# EAGLE design UARTBreakout-2.0 (EAGLE 9.6.2)
Assembly variants: JLCPCB
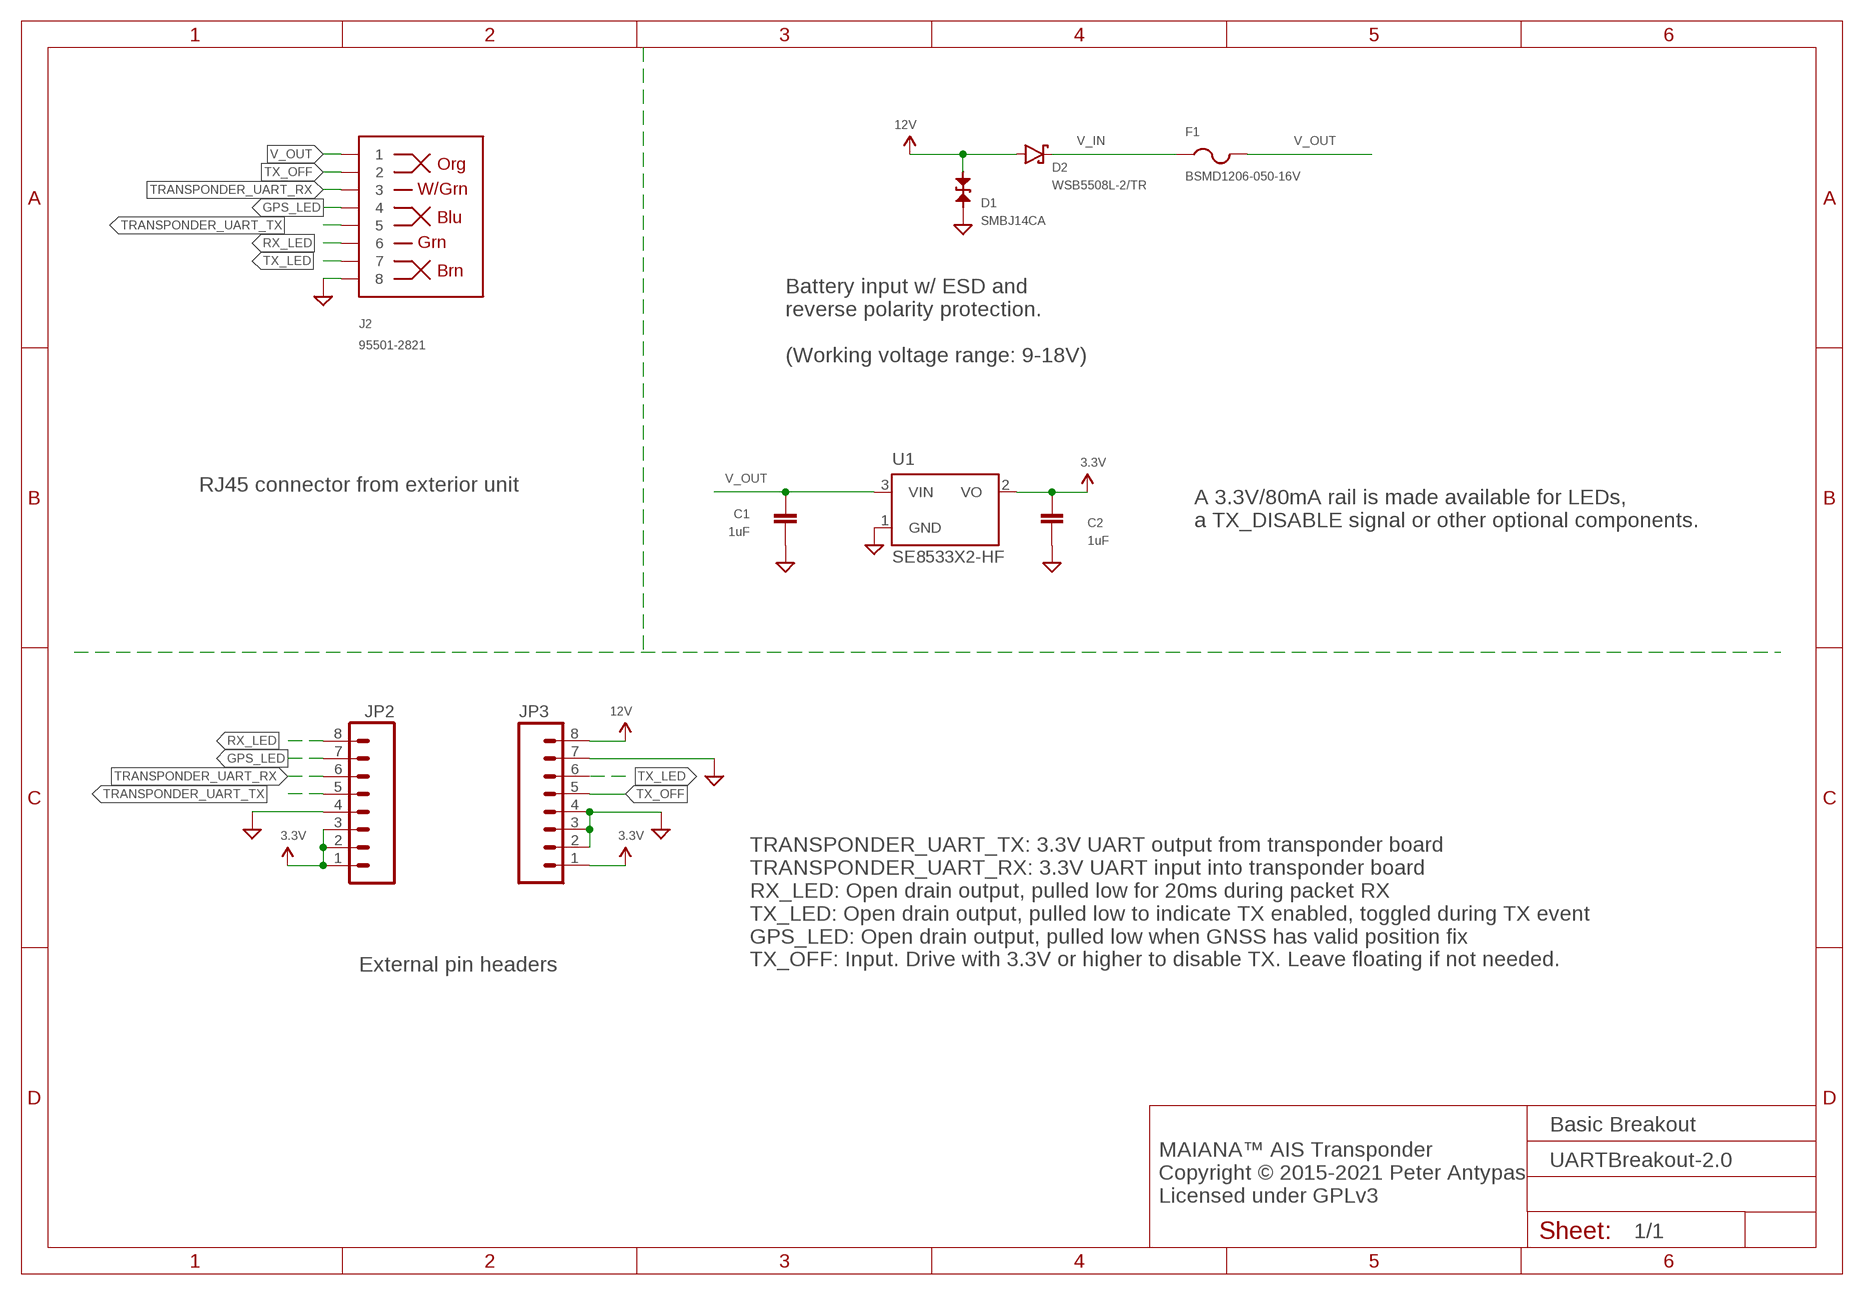
[diagram p0: schematic, sheet 1]

## Parts
C1  1uF  CAPACITOR0603  [0603]
C2  1uF  CAPACITOR0603  [0603]
D1  SMBJ14CA  DIODE-TVS-BIDIRSMB  [SMB-BIDIR]
D2  WSB5508L-2/TR  DIODE-SCHOTTKYSOD123  [SOD123]
F1  BSMD1206-050-16V  PTCFUSE-1206  [R1206]
J2  95501-2821  RJ45-8PTH  [RJ45-8]
JP2  M08SILK_FEMALE_PTH  [1X08]
JP3  M08SILK_FEMALE_PTH  [1X08]
U1  SE8533X2-HF  MCP1799T  [SOT23]

## Nets
3.3V: C2.P$1 JP2.1 JP2.2 JP2.3 JP3.1 U1.2(VO)
12V: D1.A D2.A JP3.8
GND: C1.P$2 C2.P$2 D1.C J2.8 JP2.4 JP3.2 JP3.3 JP3.4 JP3.7 U1.1(GND)
GPS_LED: J2.4 JP2.7
RX_LED: J2.6 JP2.8
TRANSPONDER_UART_RX: J2.3 JP2.6
TRANSPONDER_UART_TX: J2.5 JP2.5
TX_LED: J2.7 JP3.6
TX_OFF: J2.2 JP3.5
V_IN: D2.C F1.1
V_OUT: C1.P$1 F1.2 J2.1 U1.3(VIN)

## Notes on the sheet
- Battery input w/ ESD and 
  reverse polarity protection.
  
  (Working voltage range: 9-18V)
- RJ45 connector from exterior unit
- A 3.3V/80mA rail is made available for LEDs,
  a TX_DISABLE signal or other optional components.
- External pin headers
- TRANSPONDER_UART_TX: 3.3V UART output from transponder board
  TRANSPONDER_UART_RX: 3.3V UART input into transponder board
  RX_LED: Open drain output, pulled low for 20ms during packet RX
  TX_LED: Open drain output, pulled low to indicate TX enabled, toggled during TX event
  GPS_LED: Open drain output, pulled low when GNSS has valid position fix
  TX_OFF: Input. Drive with 3.3V or higher to disable TX. Leave floating if not needed.
- Basic Breakout
- MAIANA™ AIS Transponder
  Copyright © 2015-2021 Peter Antypas
  Licensed under GPLv3

## Library data of the parts
C1 C2 = MyPassives:CAPACITOR: Standard SMD capacitor; PARTNO: CC0603KRX5R8BB105
D1 = MyDiodes:DIODE-TVS-BIDIR: Bidirectional TVS diode; PARTNO: SMBJ14CA
D2 = MyDiodes:DIODE-SCHOTTKY: Standard SMD Schottky diode; PARTNO: WSB5508L-2/TR
F1 = adafruit:PTCFUSE: PTC fuses, resettable thermistors; PARTNO: BSMD1206-050-16V
J2 = SparkFun-Connectors:RJ45-8: RJ45 Jack Simple RJ45, 8-pin connection - connector for common Cat5, Cat5e, and Cat6 Ethernet cables. Footprint not yet proven in production. Connector sku is PRT-00643; Breakout PCB sku is BOB-00716.; PARTNO: 95501-2821; PROD_ID: CONN-08506; VALUE: RJ45
JP2 JP3 = SparkFun-Connectors:M08: Header 8 Standard 8-pin 0.1" header. Use with straight break away headers (SKU : PRT-00116), right angle break away headers (PRT-00553), swiss pins (PRT-00743), machine pins (PRT-00117), and female headers (PRT-00115).; PROD_ID: CONN-08438
U1 = microchip:MCP1799T: 80mA High Voltage Automotive LDO; PARTNO: SE8533X2-HF; VALUE: MCP1799T

## Board
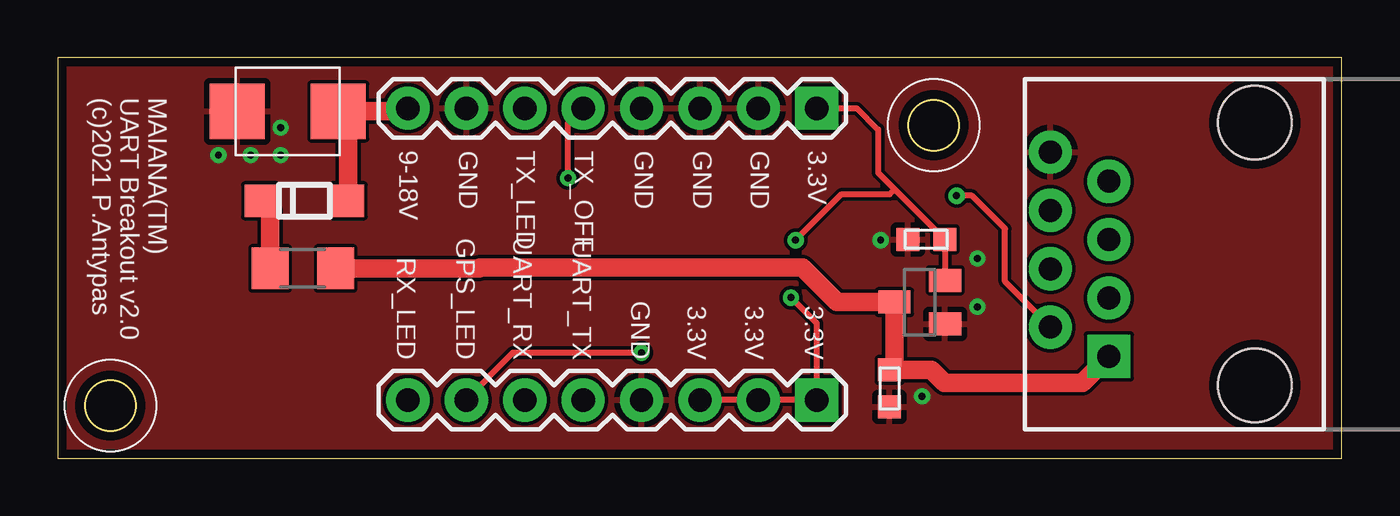
[diagram p1: board, top side]
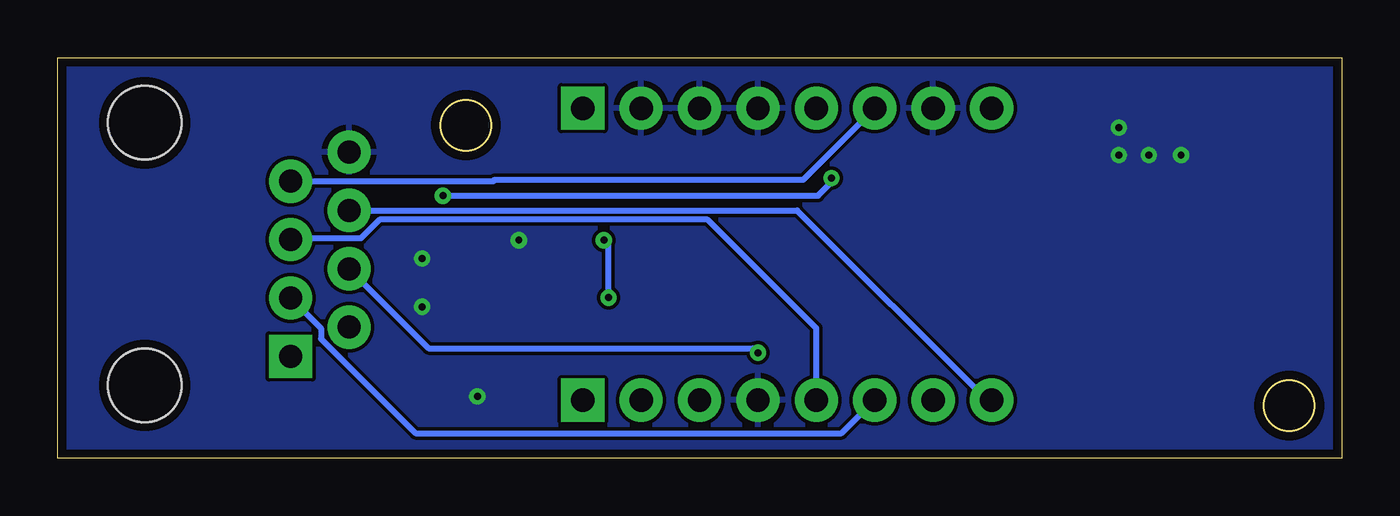
[diagram p2: board, bottom side, seen from below]

Size 55.86 x 17.45 mm. Coordinates in mm from the lower left corner, seen from the top.
Outline: 0,0 55.86,0 55.86,17.45 0,17.45 0,0
Outline: circle at 38.1,14.5 radius 1.1
Outline: circle at 2.3,2.3 radius 1.1
Copper layers (1*16): Top 0.035mm / dielectric 1.5mm / Bottom 0.035mm
Design rules "default *": minimum track width 6mil, minimum drill 0.3mm, track to track 6mil, track to pad 6mil, pad to pad 6mil, via to via 6mil, smd to smd 0mil, copper to edge 15mil, drill to drill 6mil, minimum pad ring 10mil, minimum via ring 8mil, stop-mask expansion 4mil, vias tented up to drill 20mil, thermal gap 10mil

### Footprints (pad centres in the part's own frame; a part is rotated, then mirrored left to right if it is on the bottom)
0603 = smd 1 x 1: P$1 -0.8,0; P$2 0.8,0
SMB-BIDIR = smd 2.4 x 2.4: A 2.2,0; C -2.2,0
SOD123 = smd 1.4 x 1.4: A 1.9,0; C -1.9,0
R1206 = smd 1.6 x 1.803: 1 -1.422,0; 2 1.422,0
RJ45-8 = drill 1 pad 1.88 square: 1 -4.445,6.35 | drill 1 pad 1.88: 2 -3.175,8.89; 3 -1.905,6.35; 4 -0.635,8.89; 5 0.635,6.35; 6 1.905,8.89; 7 3.175,6.35; 8 4.445,8.89 | hole 3.2: -5.715,0; 5.715,0
1X08 = drill 1.016 pad 1.88 square: 1 0,0 | drill 1.016 pad 1.88: 2 2.54,0; 3 5.08,0; 4 7.62,0; 5 10.16,0; 6 12.7,0; 7 15.24,0; 8 17.78,0
SOT23 = smd 1 x 1.4: 1 -0.95,-1.1; 2 0.95,-1.1; 3 0,1.1

### Placement (x,y rotation side)
C1  36.19,3.04 270 top
C2  37.78,9.53 180 top
D1  10.01,15.11 0 top
D2  10.73,11.21 0 top
F1  10.67,8.27 0 top
J2  52.07,8.89 90 top
JP2  33.02,2.54 180 top
JP3  33.02,15.24 180 top
U1  37.5,6.8 90 top

### Tracks (layer width: path | path; a pad name or v marks a point on that pad's centre or on a via)
3.3V  (via drill 0.3)
  Top 0.254: JP3.1 34.76,15.24 35.69,14.31 35.69,12.43 36.41,11.71 | JP2.3 JP2.2 JP2.1 33.02,5.88 v31.9,7 | 36.41,11.71 C2.P$1 38.6,9.53 U1.2 | v32.1,9.5 34.1,11.5 36.2,11.5 36.41,11.71
  Bottom 0.254: v31.9,7 31.9,9.3 v32.1,9.5
12V
  Top 0.813: D1.A 12.7,15.11 | 12.7,15.11 15.11,15.11 JP3.8 | D2.A 12.63,15.04 12.7,15.11
GND  (via drill 0.3)
  other vias: 37.6,2.7 40,8.7 40,6.6 35.8,9.5 7,13.2 8.4,13.2 9.7,13.2 9.7,14.4
  pour Top: -1.27,19.05 56.71,19.05 56.71,-1.27 -1.27,-1.27
  pour Bottom: -2.54,20.32 57.48,20.32 57.48,-3.81 -2.54,-3.81
GPS_LED  (via drill 0.3)
  Top 0.254: v25.4,4.6 19.8,4.6 17.78,2.58 JP2.7
  Bottom 0.254: J2.4 39.73,4.8 25.6,4.8 v25.4,4.6
RX_LED
  Bottom 0.254: J2.6 23.7,10.79 15.44,2.54 JP2.8
TRANSPONDER_UART_RX
  Bottom 0.254: J2.3 44.4,5.66 44.4,5.21 40.29,1.1 21.76,1.1 JP2.6
TRANSPONDER_UART_TX
  Bottom 0.254: JP2.5 22.86,5.66 27.59,10.39 41.86,10.39 42.67,9.58 45.67,9.58 J2.5
TX_LED
  Bottom 0.254: J2.7 36.91,12.06 36.85,12.13 23.43,12.13 JP3.6
TX_OFF  (via drill 0.3)
  Top 0.254: J2.2 41.2,7.7 41.2,10 39.77,11.43 v39.1,11.43 | v22.2,12.2 22.2,14.58 JP3.5
  Bottom 0.254: v39.1,11.43 22.79,11.43 22.2,12.02 v22.2,12.2
V_IN
  Top 0.813: D2.C 9.25,10.8 F1.1
V_OUT
  Top 0.813: F1.2 18.34,8.27 18.37,8.3 32.4,8.3 33.9,6.8 U1.3 | J2.1 44.58,3.3 38.56,3.3 38.02,3.85 C1.P$1 36.4,4.06 U1.3 | U1.3 36.34,6.74

### Text on the board
tNames: MAIANA(TM) / UART Breakout v2.0 / (c)2021 P.Antypas | 9-18V | GND | TX_LED | TX_OFF | GND | GND | GND | 3.3V | RX_LED | GPS_LED | UART_RX | UART_TX | GND | 3.3V | 3.3V | 3.3V